# EAGLE schematic Addon-mapleCUx_Raspi-3V3-UART-CC2530-V02-05 (EAGLE 9.1.0)
MAPLE-CUx Large Version
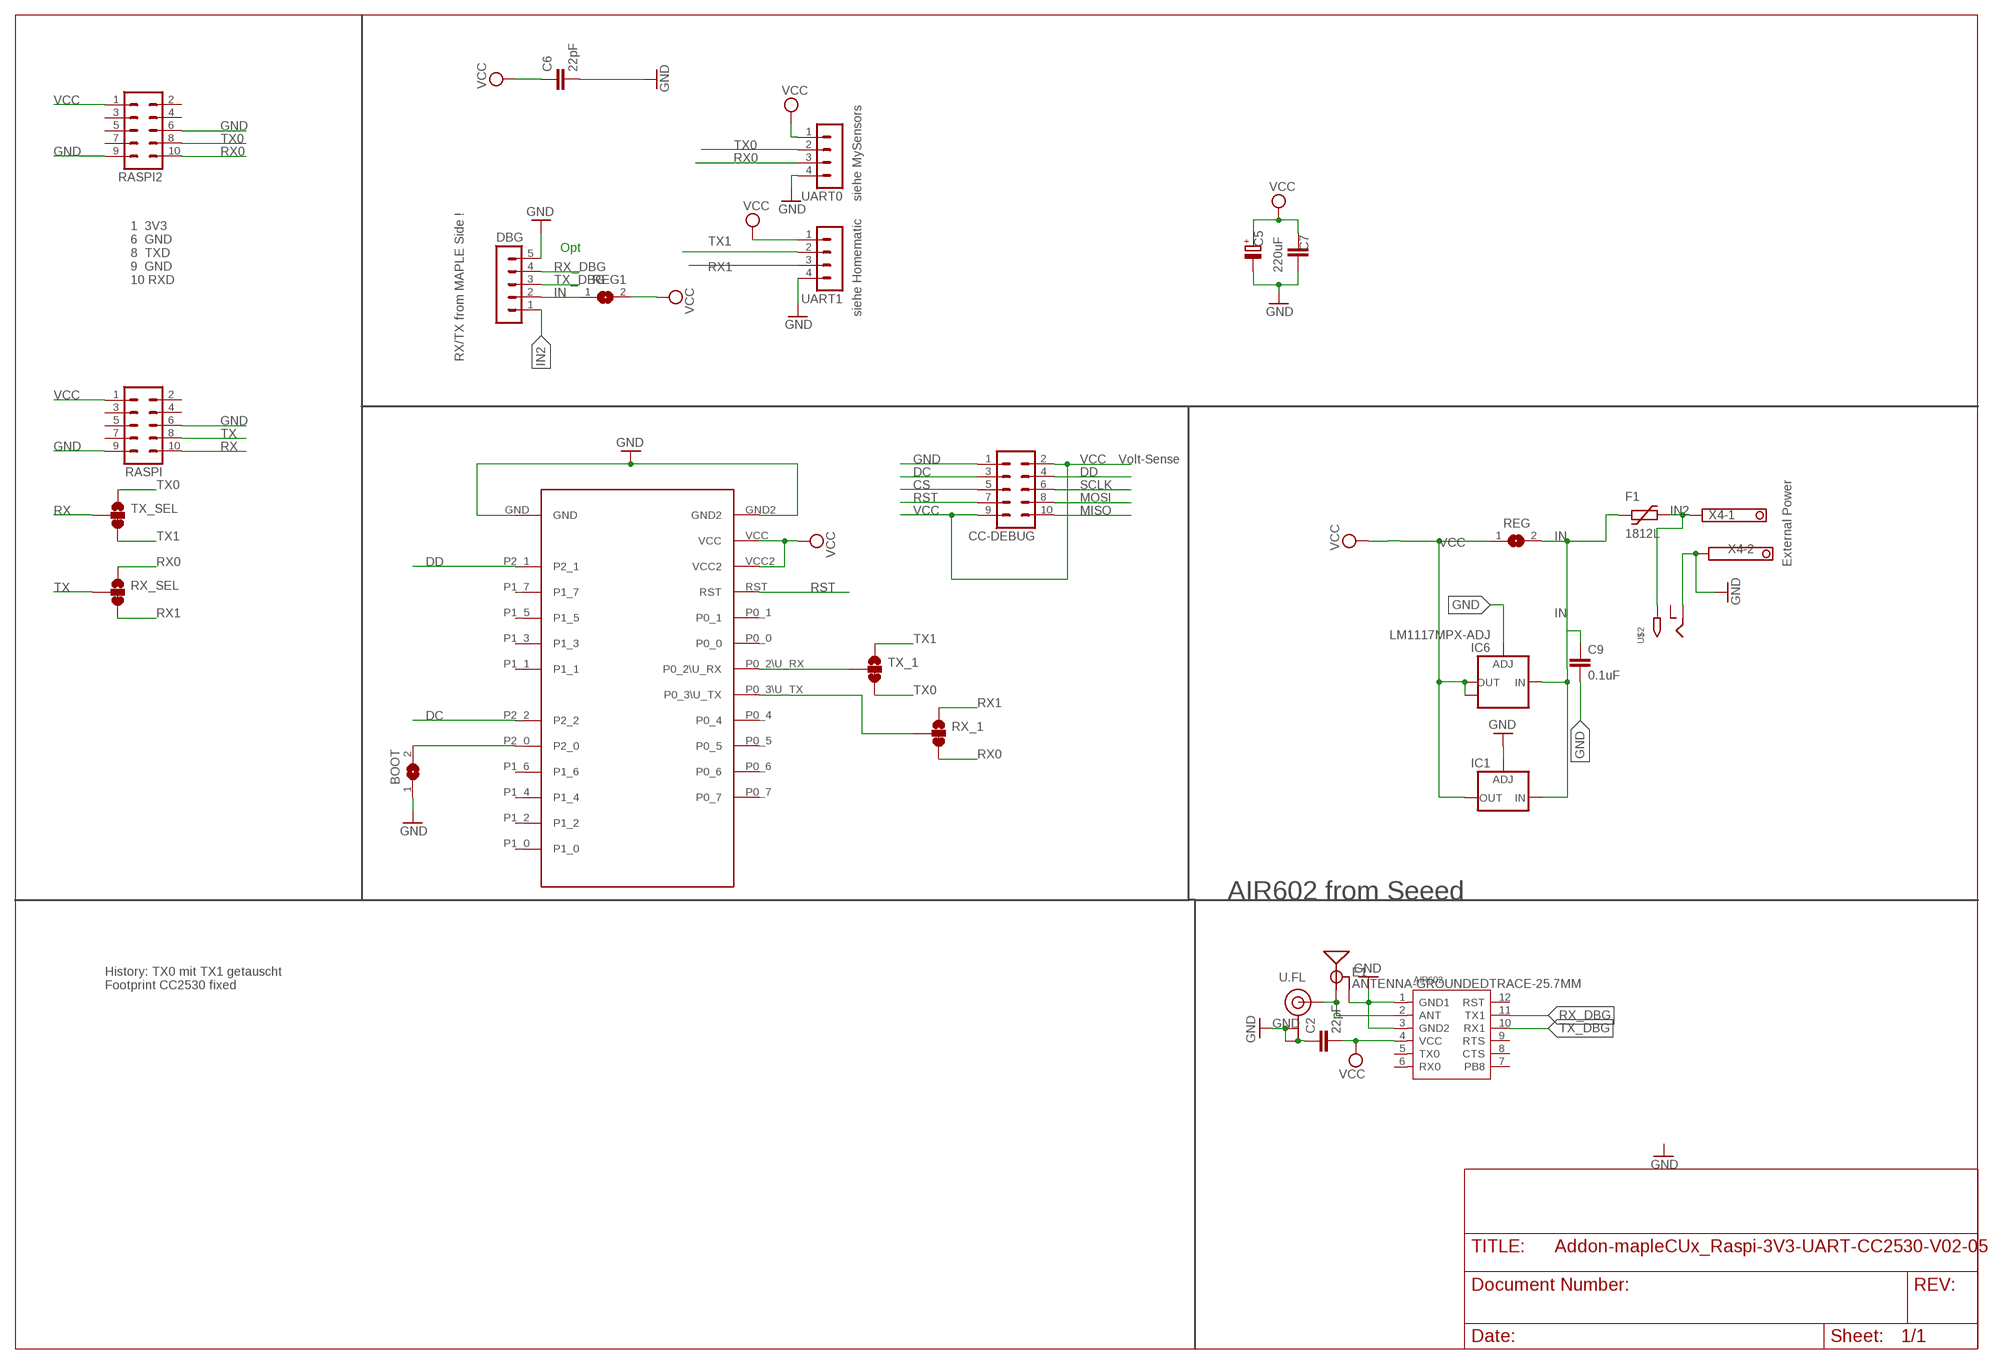
[diagram p0: schematic, sheet 1]

## Parts
AIR602  AIR602  [MODULE12P-2.0-10X12MM]
BOOT  SJ  [SJ]
C2  22pF  C-EUC0805  [C0805]
C5  220uF  CPOL-EUE5-8.5  [E5-8,5]
C6  22pF  C-EUC0805  [C0805]
C7  C-EUC1812  [C1812]
C9  0.1uF  C-EUC1206  [C1206]
CC-DEBUG  MA05-2  [MA05-2]
DBG  MA05-1  [MA05-1]
E1  ANTENNA-GROUNDEDTRACE-25.7MM  [TRACE_ANTENNA_2.4GHZ_25.7MM]
F1  1812L  [1812L]
IC1  LD117ADT50TR  [DPACK]
IC6  LM1117MPX-ADJ  [SOT223]
RASPI  MA05-2  [MA05-2]
RASPI2  MA05-2  [MA05-2]
REG  SJ  [SJ]
REG1  SJ  [SJ]
RX_1  JUMPER-SMT_3_1-NC_TRACE_SILK  [SMT-JUMPER_3_1-NC_TRACE_SILK]
RX_SEL  JUMPER-SMT_3_1-NC_TRACE_SILK  [SMT-JUMPER_3_1-NC_TRACE_SILK]
TX_1  JUMPER-SMT_3_1-NC_TRACE_SILK  [SMT-JUMPER_3_1-NC_TRACE_SILK]
TX_SEL  JUMPER-SMT_3_1-NC_TRACE_SILK  [SMT-JUMPER_3_1-NC_TRACE_SILK]
U$2  2.1MMJACKTHM  [PJ-102A]
U$3  CC2530_MODULE  [CC2530_DIL]
U.FL  U.FL  [U.FL]
UART0  MA04-1  [MA04-1]
UART1  MA04-1  [MA04-1]
X4  1751248  [1751248]

## Nets
CS: CC-DEBUG.5
DC: CC-DEBUG.3 U$3.P2_2
DD: CC-DEBUG.4 U$3.P2_1
GND [PWR]: AIR602.1(GND1) AIR602.3(GND2) BOOT.1 C2.1 C5.- C6.2 C7.1 C9.2 CC-DEBUG.1 DBG.5 E1.GND E1.GND2(GND) IC1.1(ADJ) IC6.1(ADJ) RASPI2.6 RASPI2.9 RASPI.6 RASPI.9 U$2.RING U$3.GND U$3.GND2 U.FL.1(GND) U.FL.2(GND) UART0.4 UART1.4 X4.2
IN [PWR]: C9.1 DBG.2 F1.P$1 IC1.3(IN) IC6.3(IN) REG1.1 REG.2
IN2 [PWR]: DBG.1 F1.P$2 U$2.TIP X4.1
MISO: CC-DEBUG.10
MOSI: CC-DEBUG.8
N$1: BOOT.2 U$3.P2_0
N$2: TX_1.2 U$3.P0_2\U_RX
N$3: RX_1.2 U$3.P0_3\U_TX
N$4: AIR602.2(ANT) E1.ANT(SIGNAL) U.FL.FEED(SIGNAL)
RST: CC-DEBUG.7 U$3.RST
RX: RASPI.10 TX_SEL.2
RX0: RASPI2.10 RX_1.3 RX_SEL.1 UART0.3
RX1: RX_1.1 RX_SEL.3 UART1.3
RX_DBG: AIR602.11(TX1) DBG.4
SCLK: CC-DEBUG.6
TX: RASPI.8 RX_SEL.2
TX0: RASPI2.8 TX_1.3 TX_SEL.1 UART0.2
TX1: TX_1.1 TX_SEL.3 UART1.2
TX_DBG: AIR602.10(RX1) DBG.3
VCC [PWR]: AIR602.4(VCC) C2.2 C5.+ C6.1 C7.2 CC-DEBUG.2 CC-DEBUG.9 IC1.4(OUT) IC6.2(OUT) IC6.TAB(OUT1) RASPI2.1 RASPI.1 REG1.2 REG.1 U$3.VCC U$3.VCC2 UART0.1 UART1.1
Unconnected: AIR602.5(TX0) AIR602.6(RX0) AIR602.7(PB8) AIR602.8(CTS) AIR602.9(RTS) AIR602.12(RST) RASPI2.2 RASPI2.3 RASPI2.4 RASPI2.5 RASPI2.7 RASPI.2 RASPI.3 RASPI.4 RASPI.5 RASPI.7 U$2.RING_SW U$3.P0_0 U$3.P0_1 U$3.P0_4 U$3.P0_5 U$3.P0_6 U$3.P0_7 U$3.P1_0 U$3.P1_1 U$3.P1_2 U$3.P1_3 U$3.P1_4 U$3.P1_5 U$3.P1_6 U$3.P1_7

## Notes on the sheet
- siehe MySensors
- Opt
- 1  3V3
  6  GND
  8  TXD
  9  GND
  10 RXD
- siehe Homematic
- RX/TX from MAPLE Side !
- Volt-Sense
- External Power
- AIR602 from Seeed
- History: TX0 mit TX1 getauscht
  Footprint CC2530 fixed

## Library data of the parts
AIR602 = AIR602:AIR602
BOOT REG REG1 = jumper:SJ: SMD solder JUMPER
C2 = rcl:C-EU: CAPACITOR, European symbol
C5 = rcl:CPOL-EU: POLARIZED CAPACITOR, European symbol; SPICEPREFIX: C
C6 C7 C9 = rcl:C-EU: CAPACITOR, European symbol; SPICEPREFIX: C
CC-DEBUG RASPI RASPI2 = con-lstb:MA05-2: PIN HEADER; OC_FARNELL: unknown; OC_NEWARK: unknown
DBG = con-lstb:MA05-1: PIN HEADER; OC_FARNELL: unknown; OC_NEWARK: unknown
E1 = SparkFun-RF:ANTENNA-GROUNDED: Antenna w/ Ground Connection 2.4GHz antennae with signal and ground terminals. TRACE_ANTENNA_2.4GHZ_15.2MM - Meander Trace antenna 15.2 x 5.7mm footprint Based on layout from TI app note AN043 <http://www.ti.com/lit/an/swra117d/swra117d.pdf>. TRACE_ANTENNA_2.4GHZ_25.7MM - Inverted F trace antenna 25.7 x 7.5 mm footprint. Based on layout from TI design note DN0007 <http://www.ti.com/lit/an/swru120b/swru120b.pdf>.
F1 = ptc-littlefuse:1812L
IC1 = v-reg:LD117A?*: Low drop fixed and adjustable positive voltage regulators 1 A Source: http://www.st.com/stonline/products/literature/ds/7194/ld1117axx.pdf
IC6 = lm1117:LM1117MPX-ADJ
RX_1 RX_SEL TX_1 TX_SEL = SparkFun-Jumpers:JUMPER-SMT_3_1-NC_TRACE: Normally closed trace jumper (1 of 2 connections) This jumper has a trace between two pads so it's normally closed (NC). The other connection is normally open (NO). Use a razor knife to open the connection. For best results follow the IPC guidelines for cutting traces: Cutout at least 0.063 mm (0.005 in). Remove all loose material to clean up the cut area. Seal the cut with an approved epoxy. Reapply solder to reclose the connection, or to close the NO connection.
U$2 = adafruit:2.1MMJACK: 2.1mm x 5.5mm THM DC jack with internal switch. Digikey part #PJ-102A, 4UCON part #05537 2.1mm x 5.5mm SMT DC jack with internal switch. Digikey part #PJ-002A-SMT, 4UCON part #03267 By microbuilder.eu & adafruit.com
U$3 = Martin-Communication-V4:CC2530_MODULE
U.FL = SparkFun-Connectors:U.FL: SMD Antenna Connector - U.FL 2mm height, 3.0mm x 3.0mm receptacle size. SparkFun Products: SparkFun WiFi Shield - ESP8266 <https://www.sparkfun.com/products/13287> SparkFun ESP8266 Thing <https://www.sparkfun.com/products/13231> SparkFun MiniGen - Pro Mini Signal Generator Shield <https://www.sparkfun.com/products/11420>; PROD_ID: CONN-09193; SF_ID: WRL-09144
UART0 UART1 = con-lstb:MA04-1: PIN HEADER; OC_FARNELL: unknown; OC_NEWARK: unknown
X4 = con-phoenix-350:1751248: MKDS 1/ 2-3,5 Printklemme Nennstrom: 10 A Bemessungsspannung: 160 V Raster: 3,5 mm Polzahl: 2 Montageart: Löten Anschlussart: Schraubanschluss Anschlussrichtung vom Leiter zur Platine: 0° Source: http://eshop.phoenixcontact.com .. 1751248.pdf; OC_FARNELL: unknown; OC_NEWARK: unknown

## Net classes
0 default: width 0.305 mm
1 PWR: width 0.914 mm